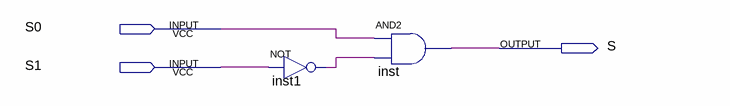
[diagram p0: schematic sheet]
// Quartus schematic mux-seletor.bdf as structural Verilog: 2 symbols, 3 pins
module \mux-seletor  (
  input  S0,
  input  S1,
  output S
);

  wire inst1_out;

  not inst1 (inst1_out, S1);
  and inst (S, S0, inst1_out);
endmodule
